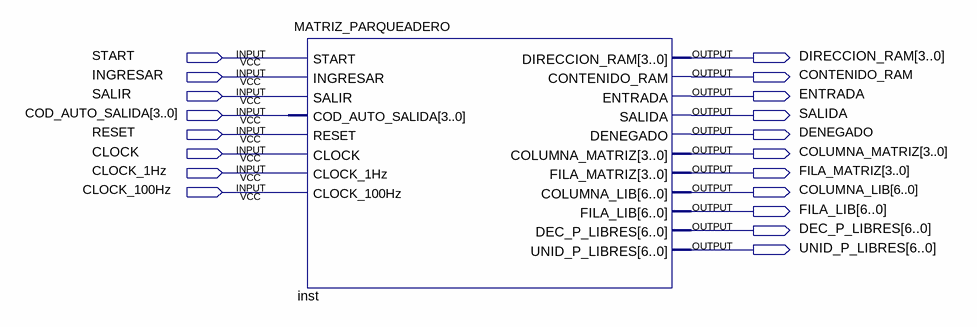
[diagram p0: schematic sheet]
// Quartus schematic BLOQUE_MATRIZ_PARQUEADERO.bdf as structural Verilog: 1 symbols, 19 pins
module BLOQUE_MATRIZ_PARQUEADERO (
  input  START,
  input  INGRESAR,
  input  SALIR,
  input  [3:0] COD_AUTO_SALIDA,
  input  RESET,
  input  CLOCK,
  input  CLOCK_1Hz,
  input  CLOCK_100Hz,
  output [3:0] DIRECCION_RAM,
  output CONTENIDO_RAM,
  output ENTRADA,
  output SALIDA,
  output DENEGADO,
  output [3:0] COLUMNA_MATRIZ,
  output [3:0] FILA_MATRIZ,
  output [6:0] COLUMNA_LIB,
  output [6:0] FILA_LIB,
  output [6:0] DEC_P_LIBRES,
  output [6:0] UNID_P_LIBRES
);

  MATRIZ_PARQUEADERO inst (
    .START(START), .INGRESAR(INGRESAR), .SALIR(SALIR), .COD_AUTO_SALIDA(COD_AUTO_SALIDA), .RESET(RESET),
    .CLOCK(CLOCK), .CLOCK_1Hz(CLOCK_1Hz), .CLOCK_100Hz(CLOCK_100Hz), .DIRECCION_RAM(DIRECCION_RAM),
    .CONTENIDO_RAM(CONTENIDO_RAM), .ENTRADA(ENTRADA), .SALIDA(SALIDA), .DENEGADO(DENEGADO),
    .COLUMNA_MATRIZ(COLUMNA_MATRIZ), .FILA_MATRIZ(FILA_MATRIZ), .COLUMNA_LIB(COLUMNA_LIB),
    .FILA_LIB(FILA_LIB), .DEC_P_LIBRES(DEC_P_LIBRES), .UNID_P_LIBRES(UNID_P_LIBRES));
endmodule
